# Altium schematic sheet 3_3Reg.SchDoc
size A4
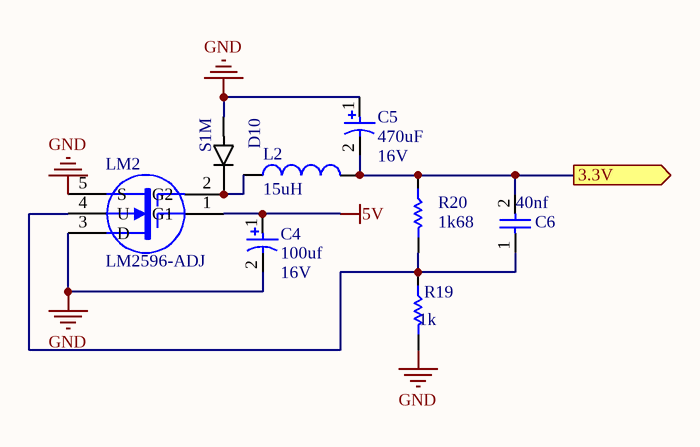
[diagram p0: 3_3Reg.SchDoc]

## Parts
C4  100uf  [RB5-10.5]
C5  470uF  [RB5-10.5]
C6  40nf  [6-0805_L]
D10  S1M  [*DIOM5227X270N_S1M(Primary)]
L2  15uH  [IND_SMD-13.0mm]
LM2  LM2596-ADJ  [T05A]
R19  1k  [6-0805_L]
R20  1k68  [6-0805_L]

## Ports
3.3V (out)

## Nets
5V: C4.1 LM2.1(G1)
GND: C4.2 C5.1 D10.A LM2.3(D) LM2.5(S) R19.2
3.3V: C5.2 C6.2 L2.2 R20.1 ; port 3.3V
NetC6_1: C6.1 LM2.4(U) R19.1 R20.2
NetD10_C: D10.C(K) L2.1 LM2.2(G2)

## Notes on the sheet
- Title
- Size:
- Date:
- A4
- Number:
- Time:
- Revision:
- Sheet
- of
- File:
- (in symbol CAP) 16V

## Library data of the parts
C4 C5 = CAP
C6 = CAP NON
D10 = S1M: S1 Series 1000 V 1 A 1 uA Surface Mount General Purpose Rectifier - DO-214AC; MF: ON Semiconductor; Price: None; Availability: Unavailable; SnapEDA_Link: https://www.snapeda.com/parts/S1M/ON%20Semiconductor/view-part/?ref=snap; Package: DO-214AC-214 ON Semiconductor; MP: S1M; Value: *
L2 = Inductor
LM2 = MOSFET-N3: Two-Gate, N-Channel MOSFET, Externally Terminated Substrate; Published: 24-Mar-1999; LatestRevisionDate: 17-Jul-2002; LatestRevisionNote: Re-released for DXP Platform.; PackageReference: T05A; Publisher: Altium Limited; PackageDescription: TO-220, Molded, 5 Lead, Straight; Code_JEDEC: TS-001-AA
R19 R20 = RESISTOR